# Altium schematic sheet PVLoad.SchDoc
size A; SheetNumber: 1; SheetTotal: 1
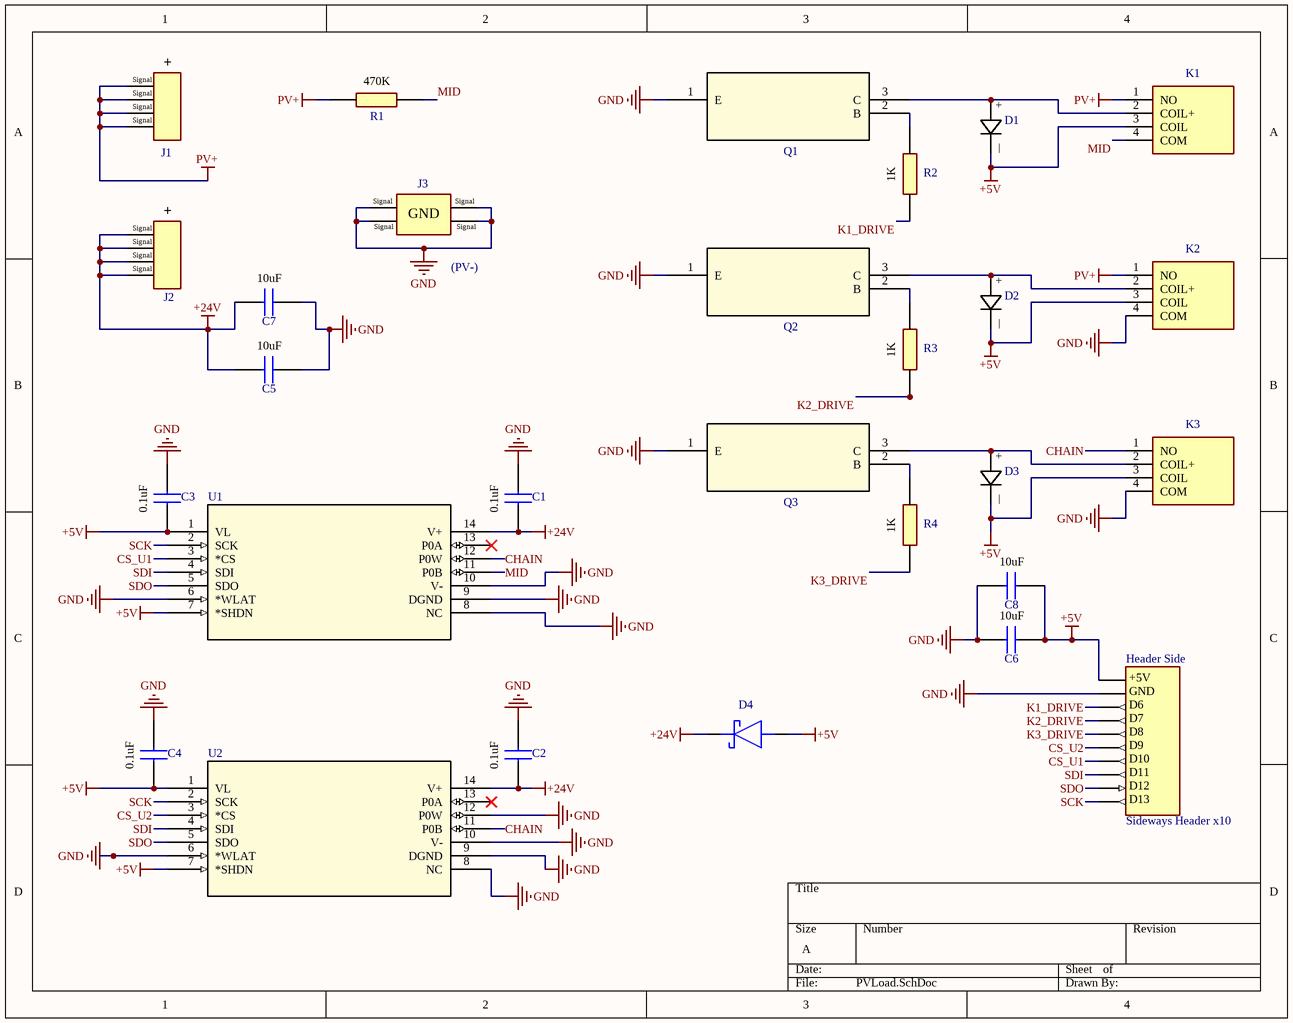
[diagram p0: PVLoad.SchDoc]

## Parts
C1  0.1uF Capacitor  [CAPC2012X95N 0.1uF]  (value not drawn)
C2  0.1uF Capacitor  [CAPC2012X95N 0.1uF]  (value not drawn)
C3  0.1uF Capacitor  [CAPC2012X95N 0.1uF]  (value not drawn)
C4  0.1uF Capacitor  [CAPC2012X95N 0.1uF]  (value not drawn)
C5  10uF Capacitor  [CAPC3225X270N 10uF]  (value not drawn)
C6  10uF Capacitor  [CAPC3225X270N 10uF]  (value not drawn)
C7  10uF Capacitor  [CAPC3225X270N 10uF]  (value not drawn)
C8  10uF Capacitor  [CAPC3225X270N 10uF]  (value not drawn)
D1  1N4148  [AXIAL_017AG_T26_ONS]  (value not drawn)
D2  1N4148  [AXIAL_017AG_T26_ONS]  (value not drawn)
D3  1N4148  [AXIAL_017AG_T26_ONS]  (value not drawn)
D4  1N5819HW1-7-F  [SODFL3518X115N]  (value not drawn)
Header_Side  Sideways Header x10  [Sideways Header x10]
J1  CT3151-2  [CALTEST_CT3151-2]  (value not drawn)
J2  CT3151-2  [CALTEST_CT3151-2]  (value not drawn)
J3  CT3151-0  [CT31510]  (value not drawn)
K1  HE3621A0540  [HE3621A0540]  (value not drawn)
K2  HE3621A0540  [HE3621A0540]  (value not drawn)
K3  HE3621A0540  [HE3621A0540]  (value not drawn)
Q1  2N3904BU  [TO-92_FAS]  (value not drawn)
Q2  2N3904BU  [TO-92_FAS]  (value not drawn)
Q3  2N3904BU  [TO-92_FAS]  (value not drawn)
R1  RC0805FR-07470KL  [RESC2012X60N 470K]  (value not drawn)
R2  RC0805FR-071KL  [RESC2012X60N 1K]  (value not drawn)
R3  RC0805FR-071KL  [RESC2012X60N 1K]  (value not drawn)
R4  RC0805FR-071KL  [RESC2012X60N 1K]  (value not drawn)
U1  MCP41HV51-502E/ST  [TSSOP14_MC_MCH-M]  (value not drawn)
U2  MCP41HV51-502E/ST  [TSSOP14_MC_MCH-M]  (value not drawn)

## Nets
+5V: C3.1 C4.1 C6.2 C8.2 D1.1 D2.1 D3.1 D4.2(A) Header_Side.1 K1.3(COIL) K2.3(COIL) K3.3(COIL) U1.1(VL) U1.7(*SHDN) U2.1(VL) U2.7(*SHDN)
+24V: C1.1 C2.1 C5.1 C7.1 D4.1(K) J2.1 J2.2 J2.3 J2.4 U1.14(V+) U2.14(V+)
GND: C1.2 C2.2 C3.2 C4.2 C5.2 C6.1 C7.2 C8.1 Header_Side.2 J3.1 J3.2 J3.3 J3.4 K2.4(COM) K3.4(COM) Q1.1(E) Q2.1(E) Q3.1(E) U1.6(*WLAT) U1.8(NC) U1.9(DGND) U1.10(V-) U2.6(*WLAT) U2.8(NC) U2.9(DGND) U2.10(V-) U2.12(P0W)
PV+: J1.1 J1.2 J1.3 J1.4 K1.1(NO) K2.1(NO) R1.1
CHAIN: K3.1(NO) U1.12(P0W) U2.11(P0B)
CS_U1: Header_Side.7 U1.3(*CS)
CS_U2: Header_Side.6 U2.3(*CS)
K1_DRIVE: Header_Side.3 R2.1
K2_DRIVE: Header_Side.4 R3.1
K3_DRIVE: Header_Side.5 R4.1
MID: K1.4(COM) R1.2 U1.11(P0B)
SCK: Header_Side.10 U1.2(SCK) U2.2(SCK)
SDI: Header_Side.8 U1.4(SDI) U2.4(SDI)
SDO: Header_Side.9 U1.5(SDO) U2.5(SDO)
NetD1_2: D1.2 K1.2(COIL+) Q1.3(C)
NetD2_2: D2.2 K2.2(COIL+) Q2.3(C)
NetD3_2: D3.2 K3.2(COIL+) Q3.3(C)
NetQ1_2: Q1.2(B) R2.2
NetQ2_2: Q2.2(B) R3.2
NetQ3_2: Q3.2(B) R4.2

Not connected (* = marked no-connect by the designer): U1 13(P0A)*; U2 13(P0A)*

## Notes on the sheet
- (near J3) (PV-)
- (in symbol 0.1uF Capacitor) 0.1uF
- (in symbol 1N4148) +; —
- (in symbol 10uF Capacitor) 10uF
- (in symbol CT3151-0) Signal; GND
- (in symbol CT3151-2) +; Signal
- (in symbol RC0805FR-071KL) 1K
- (in symbol RC0805FR-07470KL) 470K
- (in symbol Sideways Header x10) +5V; GND; D6; D7; D8; D9; D10; D11; D12; D13

## Library data of the parts
C1-C4 = 0.1uF Capacitor: Capacitor; Manufacturer_Name: SAMSUNG; Manufacturer_Part_Number: CL21B104KBCNNNC; Datasheet Link: https://datasheet.datasheetarchive.com/originals/distributors/Datasheets_SAMA/86a3eaf0882763ef32124d5901f9b833.pdf; Height: 0.95mm; Mouser Part Number: 187-CL21B104KBCNNNC; Mouser Price/Stock: https://www.mouser.co.uk/ProductDetail/Samsung-Electro-Mechanics/CL21B104KBCNNNC?qs=349EhDEZ59pEfpnm5yBEmQ%3D%3D; Arrow Part Number: CL21B104KBCNNNC; Arrow Price/Stock: https://www.arrow.com/en/products/cl21b104kbcnnnc/samsung-electro-mechanics?utm_currency=USD&region=nac
C5-C8 = 10uF Capacitor: Capacitor; Manufacturer_Name: SAMSUNG; Manufacturer_Part_Number: CL32B106KBJNNNE; Datasheet Link: https://datasheet.datasheetarchive.com/originals/distributors/Datasheets-DGA10/2406903.pdf; Height: 2.7mm; Mouser Part Number: 187-CL32B106KBJNNNE; Mouser Price/Stock: https://www.mouser.co.uk/ProductDetail/Samsung-Electro-Mechanics/CL32B106KBJNNNE?qs=349EhDEZ59rXK%2FOM74I5cg%3D%3D; Arrow Part Number: CL32B106KBJNNNE; Arrow Price/Stock: https://www.arrow.com/en/products/cl32b106kbjnnne/samsung-electro-mechanics.html?utm_currency=USD&region=nac
D1-D3 = 1N4148: No Description Available; Manufacturer_Name: onsemi; Copyright: Copyright (C) 2026 Ultra Librarian. All rights reserved.; Manufacturer_Part_Number: 1N4148
D4 = 1N5819HW1-7-F: Schottky Diode; Manufacturer_Name: Diodes Incorporated; Description: 1N5819 Schottky Diode 40V 1A SOD123F; Datasheet Link: https://www.diodes.com//assets/Datasheets/1N5819HW1.pdf; Height: 1.15mm; Manufacturer_Part_Number: 1N5819HW1-7-F; Mouser Part Number: 621-1N5819HW1-7-F; Mouser Price/Stock: https://www.mouser.co.uk/ProductDetail/Diodes-Incorporated/1N5819HW1-7-F?qs=60RJRzIpcl9ACQG7Zn63jQ%3D%3D; Arrow Part Number: 1N5819HW1-7-F; Arrow Price/Stock: https://www.arrow.com/en/products/1n5819hw1-7-f/diodes-incorporated?utm_currency=USD&region=nac
J1 J2 = CT3151-2: Banana Jack Connector Standard Banana Solder Red; MF: Cal Test; SnapEDA_Link: https://www.snapeda.com/parts/CT3151-2/Cal+Test+Electronics/view-part/?ref=snap; Package: None; Value: *; MP: CT3151-2; Check_prices: https://www.snapeda.com/parts/CT3151-2/Cal+Test+Electronics/view-part/?ref=eda
J3 = CT3151-0: 4mm Safety Jack Horizontal PCB Mount; Manufacturer_Name: Cal Test; Geometry.Height: 13.5mm; Manufacturer_Part_Number: CT3151-0; Mouser Part Number: 510-CT3151-0; Mouser Price/Stock: https://www.mouser.co.uk/ProductDetail/Cal-Test/CT3151-0?qs=vgjKjNJexTi7zzqDU3Xrcg%3D%3D; Arrow Part Number: *; Arrow Price/Stock: *; Datasheet Link: https://componentsearchengine.com/Datasheets/1/CT3151-0.pdf
K1-K3 = HE3621A0540: Reed Relay 5VDC 500Ohm 0.5A SPST-NO(20.2x6.05x7.87)mm THT Dry; Manufacturer_Name: LITTELFUSE; Geometry.Height: 7.87mm; Manufacturer_Part_Number: HE3621A0540; Mouser Part Number: 934-HE3621A0540; Mouser Price/Stock: https://www.mouser.co.uk/ProductDetail/Littelfuse/HE3621A0540?qs=X8LBAgEWIKIUBLwFF6DU2A%3D%3D; Arrow Part Number: HE3621A0540; Arrow Price/Stock: https://www.arrow.com/en/products/he3621a0540/littelfuse?utm_currency=USD&region=nac; Datasheet Link: https://m.littelfuse.com/~/media/electronics/datasheets/reed_relays/littelfuse_reed_relays_he3600_datasheet.pdf.pdf
Q1-Q3 = 2N3904BU: No Description Available; Manufacturer_Name: onsemi / Fairchild Semiconductor; Copyright: Copyright (C) 2026 Ultra Librarian. All rights reserved.; Manufacturer_Part_Number: 2N3904BU; RefDes: RefDes; Type: Type
R1 = RC0805FR-07470KL: Resistor; Manufacturer_Name: Yageo Group; Datasheet Link: http://www.yageo.com/documents/recent/PYu-RC_Group_51_RoHS_L_10.pdf; Height: 0.6mm; Manufacturer_Part_Number: RC0805FR-07470KL; Mouser Part Number: 603-RC0805FR-07470KL; Mouser Price/Stock: https://www.mouser.com/Search/ProductDetail.aspx?qs=SufOd%252bAGZfh3Zo2uEHI0rQ%3d%3d; Arrow Part Number: RC0805FR-07470KL; Arrow Price/Stock: https://www.arrow.com/en/products/rc0805fr-07470kl/yageo.html?utm_currency=USD&region=nac
R2-R4 = RC0805FR-071KL: Resistor; Manufacturer_Name: TDK; Datasheet Link: https://www.yageo.com/upload/media/product/productsearch/datasheet/rchip/PYu-RC_Group_51_RoHS_L_11.pdf; Height: 0.6mm; Manufacturer_Part_Number: RC0805FR-071KL
U1 U2 = MCP41HV51-502EST: No Description Available; Manufacturer_Name: Microchip; Copyright: Copyright (C) 2026 Ultra Librarian. All rights reserved.; Manufacturer_Part_Number: MCP41HV51-502E/ST; RefDes: RefDes; Type: Type